# EAGLE design CellRev4 (EAGLE 6.4)
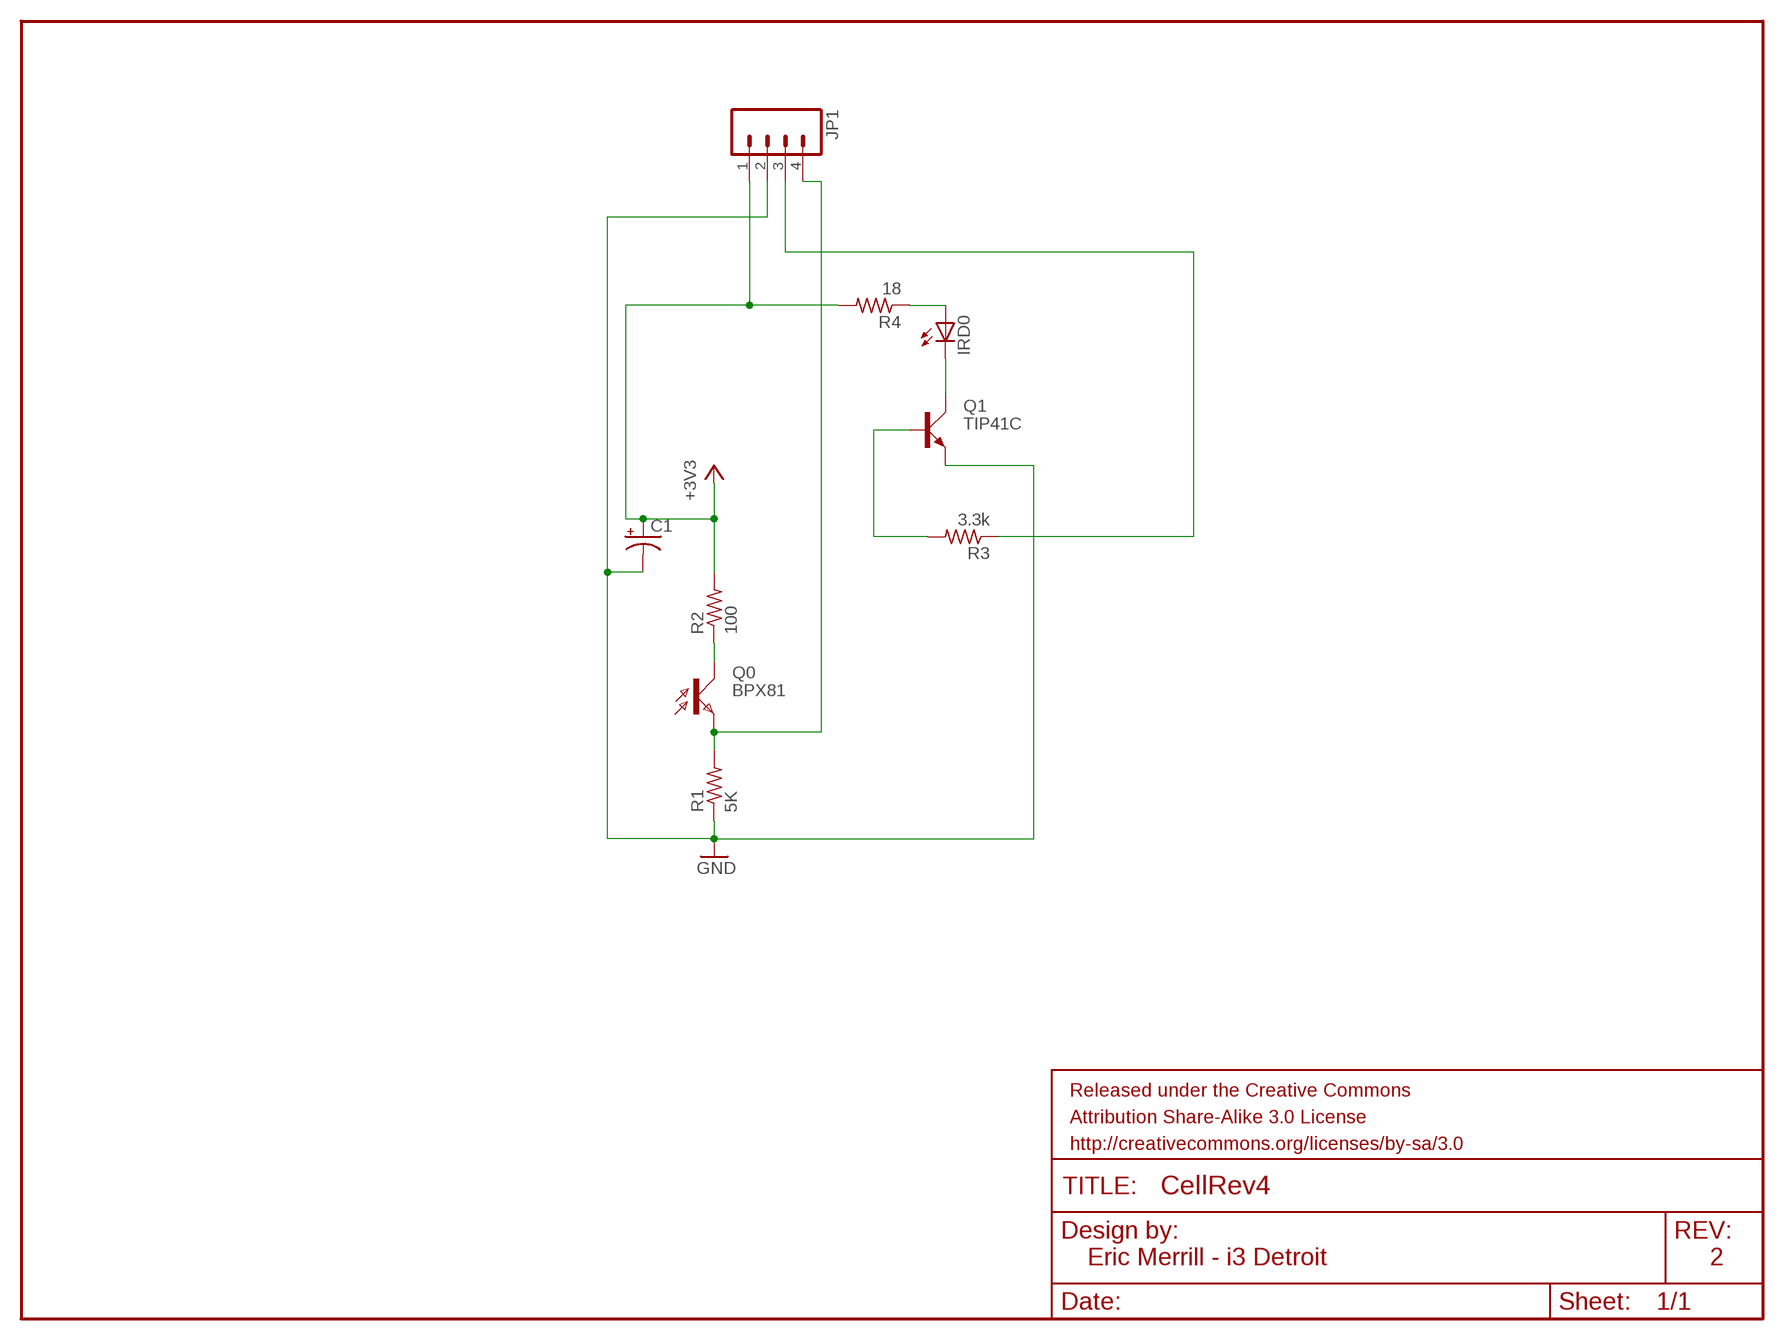
[diagram p0: schematic, sheet 1]

## Parts
C1  CAP_POLPTH1  [CPOL-RADIAL-100UF-25V]
FRAME1  FRAME-LETTER  [CREATIVE_COMMONS]
IRD0  LED5MM  [LED5MM]
JP1  M04POLAR  [MOLEX-1X4]
Q0  BPX81  [BPX81]
Q1  TIP41C  [TO220AV]
R1  5K  R-US_0207/10  [0207/10]
R2  100  R-US_0207/10  [0207/10]
R3  3.3k  R-US_0207/10  [0207/10]
R4  18  R-US_0207/10  [0207/10]

## Nets
+3V3: C1.1(+) JP1.1 R2.2 R4.2
GND: C1.2(-) JP1.2 Q1.E R1.1
N$1: Q0.C R2.1
N$3: Q1.B R3.2
N$4: IRD0.K(C) Q1.C
N$7: IRD0.A R4.1
SENSE: JP1.4 Q0.E R1.2
SWITCH: JP1.3 R3.1

## Notes on the sheet
- Eric Merrill - i3 Detroit | 2

## Library data of the parts
C1 = SparkFun-Capacitors:CAP_POL: Capacitor Polarized These are standard SMD and PTH capacitors. Normally 10uF, 47uF, and 100uF in electrolytic and tantalum varieties. Always verify the external diameter of the through hole cap, it varies with capacity, voltage, and manufacturer. The EIA devices should be standard.
FRAME1 = SparkFun-Aesthetics:FRAME-LETTER: Schematic Frame Standard 8.5x11 US Letter frame
IRD0 = adafruit:LED: LED OSRAM: - CHIPLED LG R971, LG N971, LY N971, LG Q971, LY Q971, LO R971, LY R971 LH N974, LH R974 LS Q976, LO Q976, LY Q976 LO Q996 - Hyper CHIPLED LW Q18S LB Q993, LB Q99A, LB R99A - SideLED LS A670, LO A670, LY A670, LG A670, LP A670 LB A673, LV A673, LT A673, LW A673 LH A674 LY A675 LS A676, LA A676, LO A676, LY A676, LW A676 LS A679, LY A679, LG A679 - Hyper Micro SIDELED® LS Y876, LA Y876, LO Y876, LY Y876 LT Y87S - SmartLED LW L88C, LW L88S LB L89C, LB L89S, LG L890 LS L89K, LO L89K, LY L89K LS L896, LA L896, LO L896, LY L896 - TOPLED LS T670, LO T670, LY T670, LG T670, LP T670 LSG T670, LSP T670, LSY T670, LOP T670, LYG T670 LG T671, LOG T671, LSG T671 LB T673, LV T673, LT T673, LW T673 LH T674 LS T676, LA T676, LO T676, LY T676, LB T676, LH T676, LSB T676, LW T676 LB T67C, LV T67C, LT T67C, LS T67K, LO T67K, LY T67K, LW E67C LS E67B, LA E67B, LO E67B, LY E67B, LB E67C, LV E67C, LT E67C LW T67C LS T679, LY T679, LG T679 LS T770, LO T770, LY T770, LG T770, LP T770 LB T773, LV T773, LT T773, LW T773 LH T774 LS E675, LA E675, LY E675, LS T675 LS T776, LA T776, LO T776, LY T776, LB T776 LHGB T686 LT T68C, LB T68C - Hyper Mini TOPLED® LB M676 - Mini TOPLED Santana® LG M470 LS M47K, LO M47K, LY M47K Source: http://www.osram.convergy.de/
JP1 = SparkFun-Connectors:M04: Header 4 Standard 4-pin 0.1" header. Use with straight break away headers (SKU : PRT-00116), right angle break away headers (PRT-00553), swiss pins (PRT-00743), machine pins (PRT-00117), and female headers (PRT-00115). Molex polarized connector foot print use with SKU : PRT-08231 with associated crimp pins and housings. 1MM SMD Version SKU: PRT-10208
Q0 = opto-trans-siemens:BPX81: PHOTO TRANSISTOR; OC_FARNELL: unknown; OC_NEWARK: unknown
Q1 = transistor-power:TIP41C: NPN TRANSISTOR
R1-R4 = resistor:R-US_: RESISTOR, American symbol

## Board
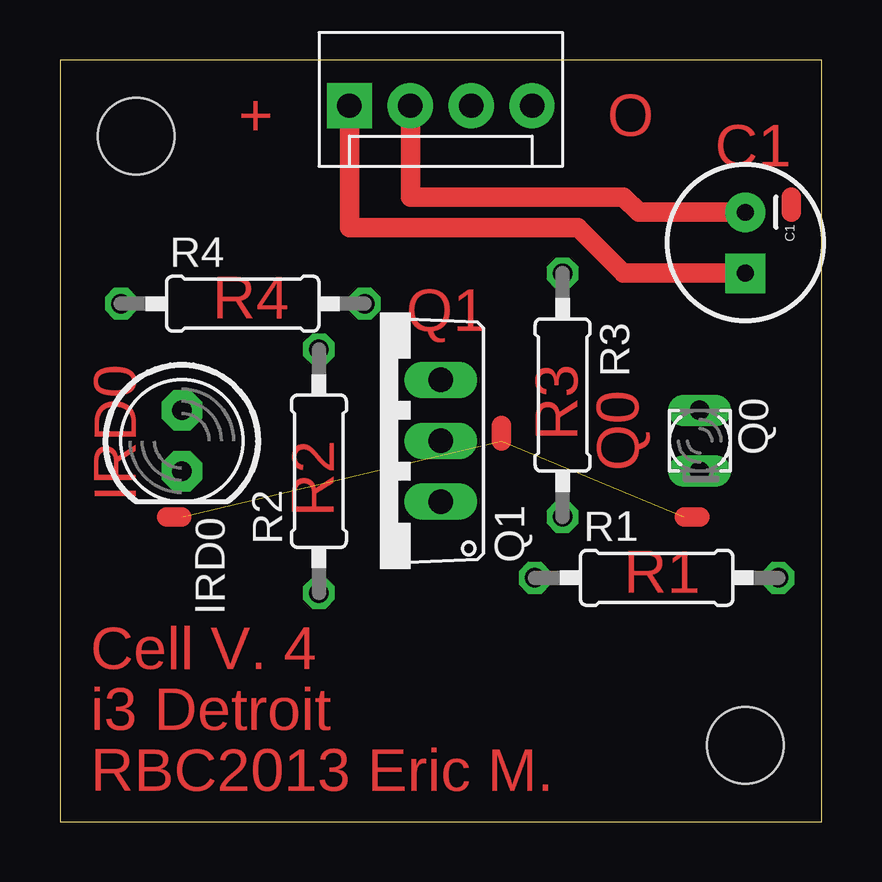
[diagram p1: board, top side]
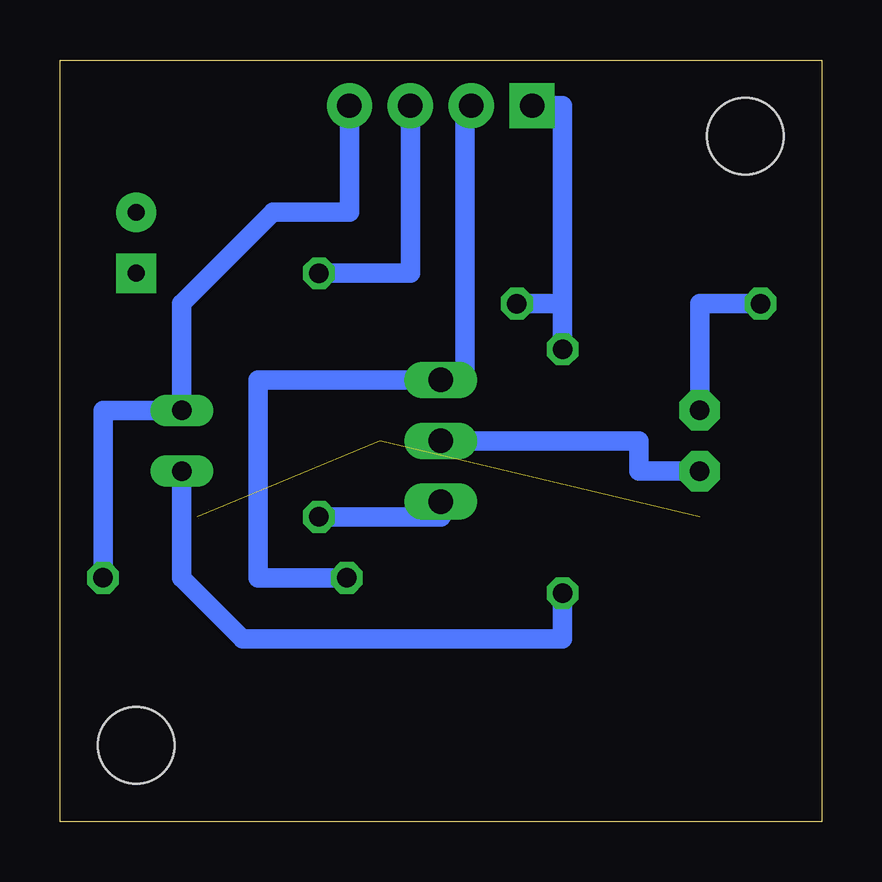
[diagram p2: board, bottom side, seen from below]

Size 31.75 x 31.75 mm. Coordinates in mm from the lower left corner, seen from the top.
Outline: 0,0 31.75,0 31.75,31.75 0,31.75 0,0
Copper layers (1*16): Top 0.035559375mm / dielectric 1.501140625mm / Bottom 0.035559375mm
Design rules "typical_4pcb": minimum track width 10mil, minimum drill 15mil, track to track 6mil, track to pad 6mil, pad to pad 6mil, via to via 6mil, smd to smd 6mil, copper to edge 15mil, drill to drill 8mil, minimum pad ring 10mil, minimum via ring 8mil, stop-mask expansion 4mil, vias tented up to drill 0mil, thermal gap 10mil
Holes 3.2 mm at 28.57,3.17 3.17,28.57

### Footprints (pad centres in the part's own frame; a part is rotated, then mirrored left to right if it is on the bottom)
CPOL-RADIAL-100UF-25V = drill 0.7 pad 1.651 square: 1 1.27,0 | drill 0.7 pad 1.651: 2 -1.27,0
LED5MM = drill 0.813 pad 1.676 octagon: A -1.27,0; K 1.27,0
MOLEX-1X4 = drill 1.016 pad 1.88 square: 1 0,0 | drill 1.016 pad 1.88: 2 2.54,0; 3 5.08,0; 4 7.62,0
BPX81 = drill 0.813 long: C 1.27,0; E -1.27,0
TO220AV = drill 1.016 long: B -2.54,-2.54; C 0,-2.54; E 2.54,-2.54
0207/10 = drill 0.813 octagon: 1 -5.08,0; 2 5.08,0

### Placement (x,y rotation side)
C1  28.57,24.13 270 top
FRAME1  26.67,-13.97 0 top  (outside the outline)
IRD0  5.08,15.88 270 top
JP1  12.06,29.84 0 top
Q0  26.67,15.88 270 top
Q1  13.34,15.88 90 top
R1  24.87,10.16 0 top
R2  10.79,14.61 90 top
R3  20.95,17.78 270 top
R4  7.62,21.59 0 top

### Tracks (layer width: path | path; a pad name or v marks a point on that pad's centre or on a via)
+3V3
  Top 0.813: JP1.1 12.06,24.77 21.59,24.77 23.5,22.86 C1.1
  Bottom 0.813: R4.2 10.79,21.59 | 10.79,21.59 R2.2 | JP1.1 10.79,29.84 10.79,21.59
GND
  Top 0.813: JP1.2 14.61,26.04 23.5,26.04 24.13,25.4 C1.2
  Bottom 0.813: R1.1 23.5,10.16 23.5,18.41 Q1.E 14.88,18.41 14.88,29.84 JP1.2
N$1
  Bottom 0.813: R2.1 10.79,7.62 24.13,7.62 26.67,10.16 Q0.C
N$2  (2 unrouted)
  Top 0.813: 4.45,12.7 5.08,12.7 | 26.04,12.7 26.67,12.7 | 18.41,15.88 18.41,16.51 | 30.48,25.4 30.48,26.04
N$3
  Bottom 0.813: Q1.B 15.88,12.7 R3.2
N$4
  Bottom 0.813: IRD0.K 7.62,14.61 7.62,15.88 Q1.C
N$7
  Bottom 0.813: R4.1 5.08,21.59 IRD0.A
SENSE
  Bottom 0.813: R1.2 29.95,17.14 Q0.E 26.67,21.59 22.86,25.4 19.68,25.4 JP1.4
SWITCH
  Bottom 0.813: R3.1 17.14,22.86 JP1.3

### Text on the board
Top: + | O | C1 | Q1 | R4 | R3 | Q0 | IRD0 | R2 | R1 | Cell V. 4 | i3 Detroit | RBC2013 Eric M.